# EAGLE design AlimSoloBatterie (EAGLE 9.3.0)
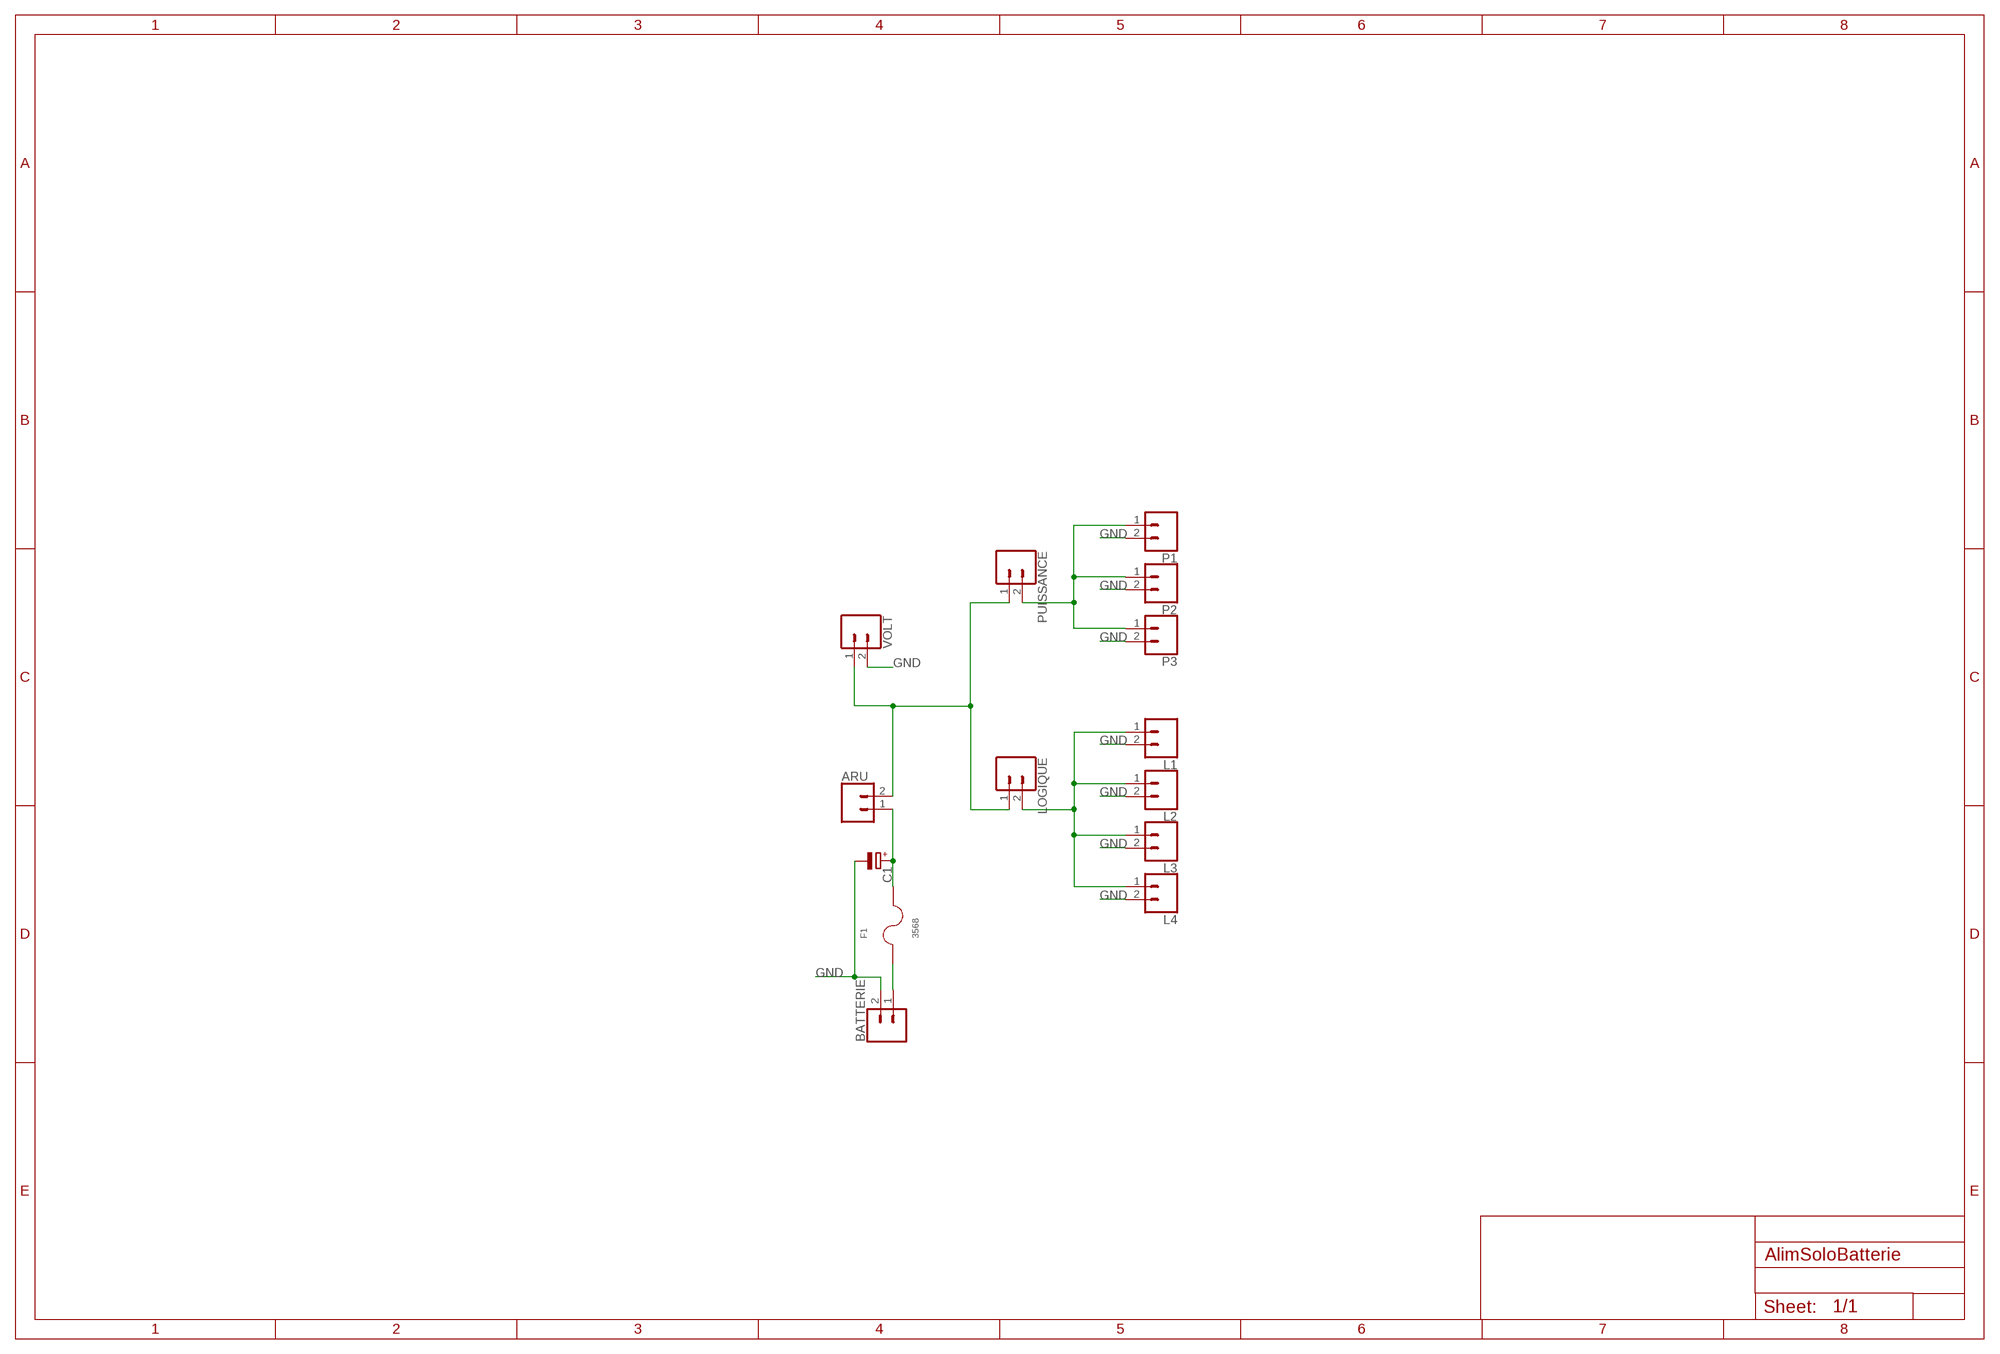
[diagram p0: schematic, sheet 1]

## Parts
ARU  CONN_02POLAR  [MOLEX-1X2]
BATTERIE  CONN_02POLAR  [MOLEX-1X2]
C1  CPOL-EUE5-13  [E5-13]
F1  3568  [FUSE_3568]
L1  CONN_02POLAR  [MOLEX-1X2]
L2  CONN_02POLAR  [MOLEX-1X2]
L3  CONN_02POLAR  [MOLEX-1X2]
L4  CONN_02POLAR  [MOLEX-1X2]
LOGIQUE  CONN_02POLAR  [MOLEX-1X2]
P1  CONN_02POLAR  [MOLEX-1X2]
P2  CONN_02POLAR  [MOLEX-1X2]
P3  CONN_02POLAR  [MOLEX-1X2]
PUISSANCE  CONN_02POLAR  [MOLEX-1X2]
VOLT  CONN_02POLAR  [MOLEX-1X2]

## Nets
GND: BATTERIE.2 C1.- L1.2 L2.2 L3.2 L4.2 P1.2 P2.2 P3.2 VOLT.2
N$1: BATTERIE.1 F1.1 F1.3
N$2: ARU.1 C1.+ F1.2 F1.4
N$3: ARU.2 LOGIQUE.1 PUISSANCE.1 VOLT.1
N$4: P1.1 P2.1 P3.1 PUISSANCE.2
N$5: L1.1 L2.1 L3.1 L4.1 LOGIQUE.2

## Library data of the parts
ARU BATTERIE L1-L4 LOGIQUE P1-P3 PUISSANCE VOLT = SparkFun-Connectors:CONN_02: Multi connection point. Often used as Generic Header-pin footprint for 0.1 inch spaced/style header connections On any of the 0.1 inch spaced packages, you can populate with these: Break Away Headers - Straight <https://www.sparkfun.com/products/116> (PRT-00116) Break Away Male Headers - Right Angle <https://www.sparkfun.com/products/553> (PRT-00553) Female Headers <https://www.sparkfun.com/products/115> (PRT-00115) Break Away Headers - Machine Pin <https://www.sparkfun.com/products/117> (PRT-00117) Break Away Female Headers - Swiss Machine Pin <https://www.sparkfun.com/products/743> (PRT-00743) For SCREWTERMINALS and SPRING TERMINALS visit here: Screw Terimnals on SparkFun.com <https://www.sparkfun.com/search/results?term=Screw+Terminals> (5mm/3.5mm/2.54mm spacing) This device is also useful as a general connection point to wire up your design to another part of your project. Our various solder wires solder well into these plated through hole pads. Hook-Up Wire - Assortment (Stranded, 22 AWG) <https://www.sparkfun.com/products/11375> (PRT-11375) Hook-Up Wire - Assortment (Solid Core, 22 AWG) <https://www.sparkfun.com/products/11367> (PRT-11367) View the entire wire category on our website here <https://www.sparkfun.com/categories/141> Special notes: Molex polarized connector foot print use with: PRT-08233 with associated crimp pins and housings. 2.54_SCREWTERM for use with PRT-10571. 3.5mm Screw Terminal footprints for PRT-08084 5mm Screw Terminal footprints for use with PRT-08432; SF_ID: PRT-09918
C1 = rcl:CPOL-EU: POLARIZED CAPACITOR, European symbol; SPICEPREFIX: C
F1 = CarFuseHolder:3568: Check availability <https://pricing.snapeda.com/parts/3568/Keystone%20Electronics/view-part?ref=eda>; AVAILABILITY: In Stock; DESCRIPTION: THM-Vertical Entry Mini Auto Blade Fuse Holder; MF: Keystone Electronics; MP: 3568; PACKAGE: NON STANDARD Keystone; PRICE: None; PURCHASE-URL: https://pricing.snapeda.com/search/part/3568/?ref=eda

## Board
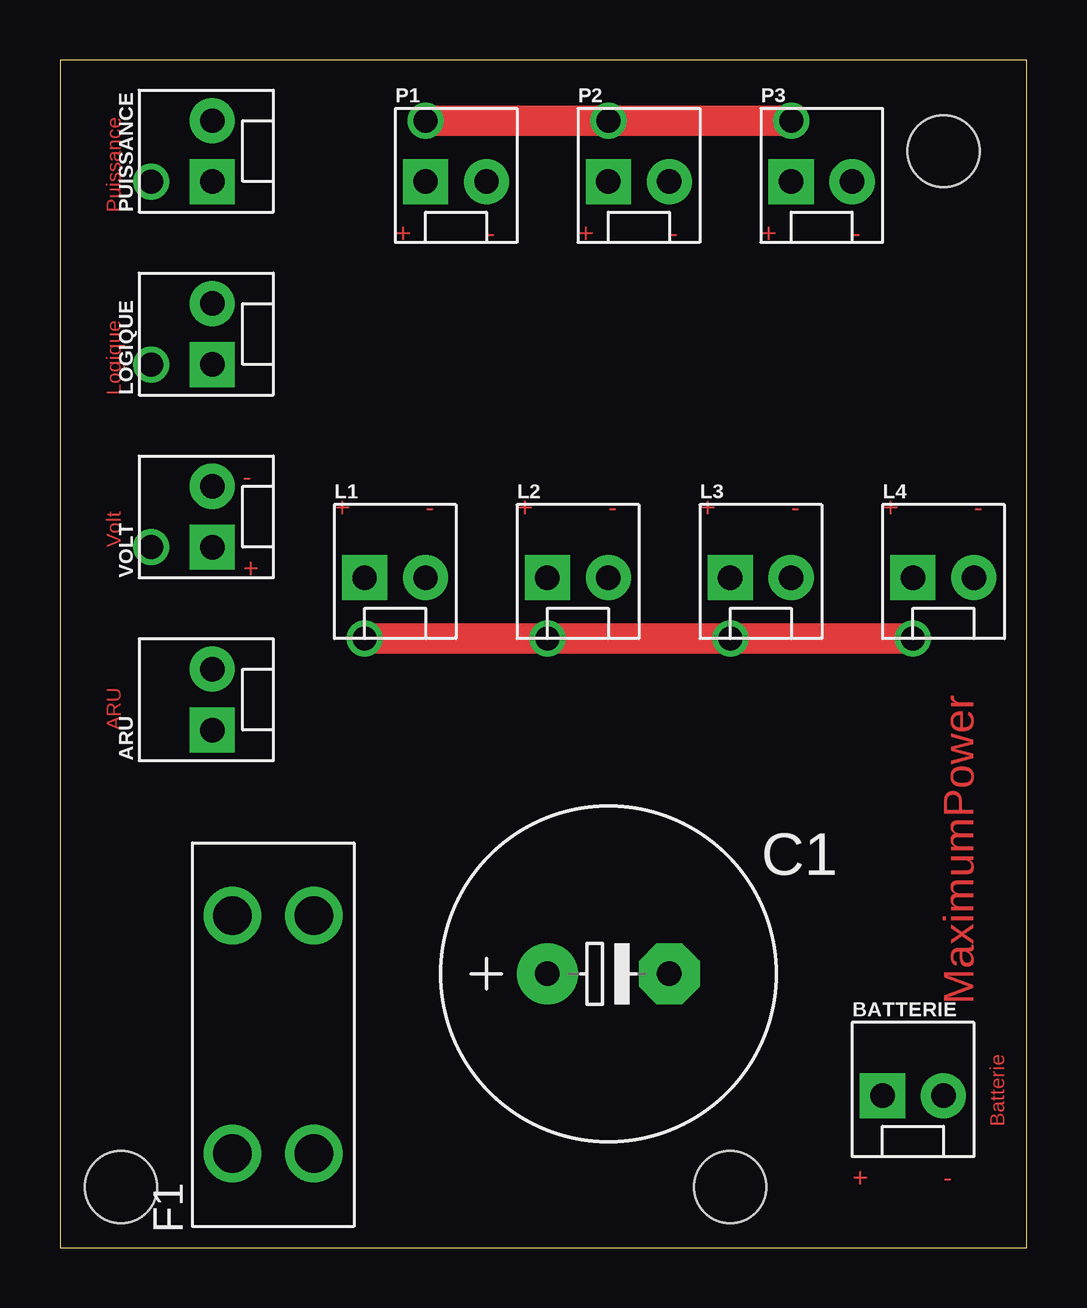
[diagram p1: board, top side]
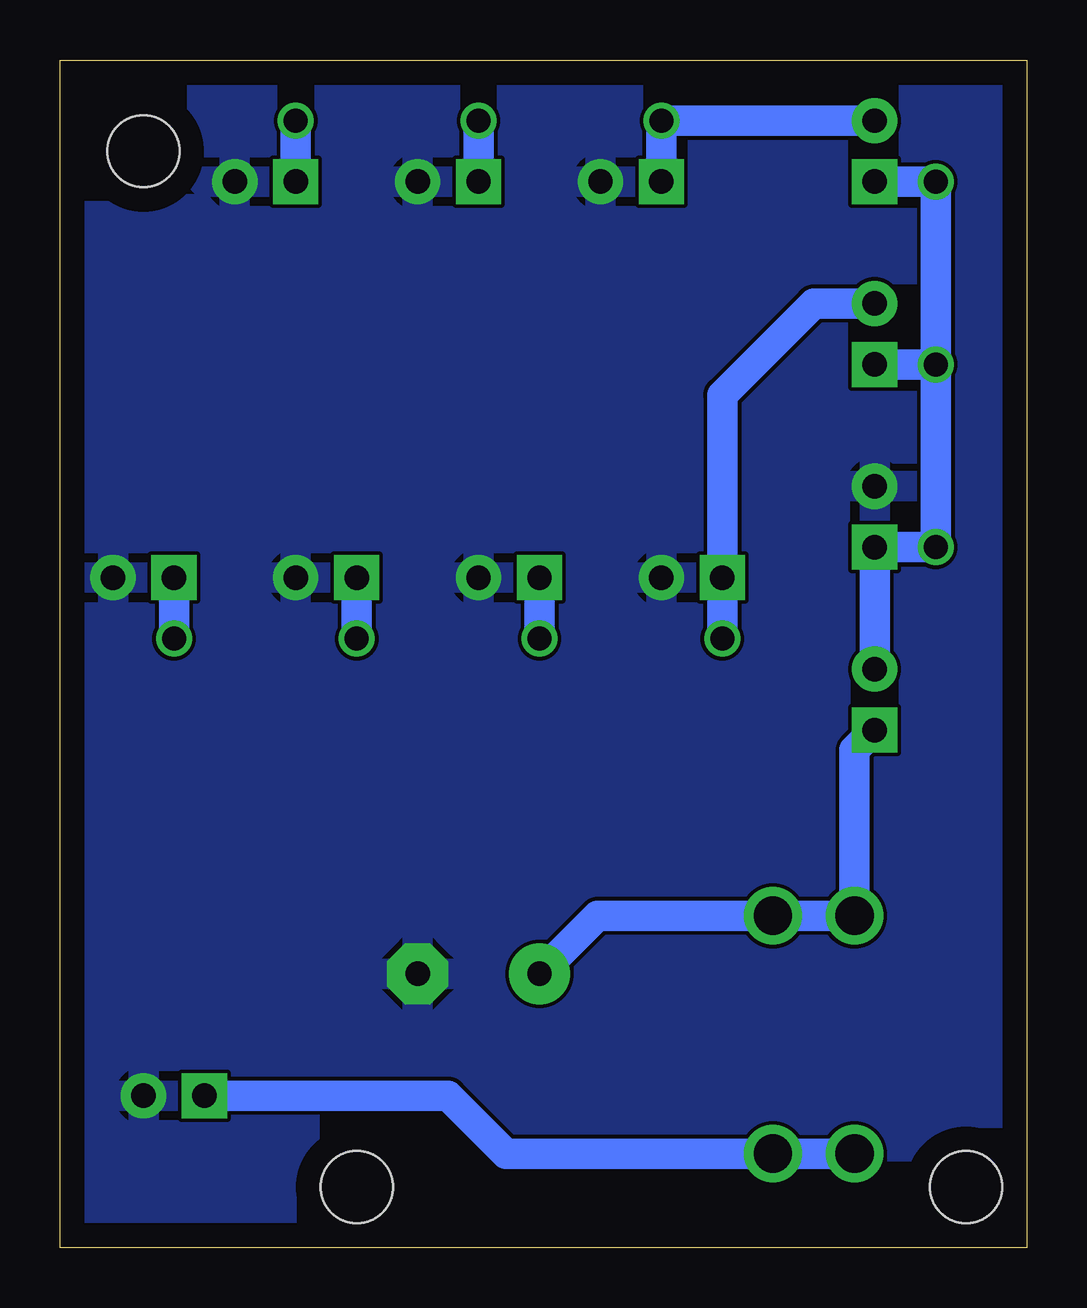
[diagram p2: board, bottom side, seen from below]

Size 40.31 x 49.52 mm. Coordinates in mm from the lower left corner, seen from the top.
Outline: 0,0 40.31,0 40.31,49.52 0,49.52 0,0
Copper layers (1*16): Top 0.035mm / dielectric 1.5mm / Bottom 0.035mm
Design rules "default": minimum track width 6mil, minimum drill 0.35mm, track to track 6mil, track to pad 6mil, pad to pad 6mil, via to via 6mil, smd to smd 6mil, copper to edge 40mil, drill to drill 6mil, minimum pad ring 10mil, minimum via ring 8mil, stop-mask expansion 4mil, vias tented up to drill 0mil, thermal gap 10mil
Holes 3 mm at 36.83,45.72 27.94,2.54 2.54,2.54

### Footprints (pad centres in the part's own frame; a part is rotated, then mirrored left to right if it is on the bottom)
MOLEX-1X2 = drill 1.016 pad 1.88 square: 1 0,0 | drill 1.016 pad 1.88: 2 2.54,0
E5-13 = drill 1.016 pad 2.54: + -2.54,0 | drill 1.016 pad 2.54 octagon: - 2.54,0
FUSE_3568 = drill 1.6: 1 -4.96,1.7; 2 4.96,1.7; 3 -4.96,-1.7; 4 4.96,-1.7

### Placement (x,y rotation side)
ARU  6.35,21.59 90 top
BATTERIE  34.29,6.35 0 top
C1  22.86,11.43 0 top
F1  8.89,8.89 90 top
L1  12.7,27.94 0 top
L2  20.32,27.94 0 top
L3  27.94,27.94 0 top
L4  35.56,27.94 0 top
LOGIQUE  6.35,36.83 90 top
P1  15.24,44.45 0 top
P2  22.86,44.45 0 top
P3  30.48,44.45 0 top
PUISSANCE  6.35,44.45 90 top
VOLT  6.35,29.21 90 top

### Tracks (layer width: path | path; a pad name or v marks a point on that pad's centre or on a via)
GND
  pour Bottom: 0,49.53 40.64,49.53 40.64,0 0,0
N$1
  Bottom 1.27: 10.71,3.81 F1.3 | F1.3 F1.1 | F1.3 21.71,3.93 24.13,6.35 BATTERIE.1
N$2
  Bottom 1.27: C1.+ 17.9,13.85 F1.4 F1.2 7.19,20.75 ARU.1
N$3  (via drill 1)
  Bottom 1.27: ARU.2 VOLT.1 v3.81,29.21 v3.81,36.83 | LOGIQUE.1 v3.81,36.83 | PUISSANCE.1 v3.81,44.45 v3.81,36.83
N$4  (via drill 1)
  Top 1.27: v15.24,46.99 v22.86,46.99 v30.48,46.99
  Bottom 1.27: PUISSANCE.2 v15.24,46.99 P1.1 | v30.48,46.99 P3.1 | P2.1 v22.86,46.99
N$5  (via drill 1)
  Top 1.27: v12.7,25.4 v20.32,25.4 v27.94,25.4 v35.56,25.4
  Bottom 1.27: LOGIQUE.2 8.89,39.37 12.7,35.56 L1.1 v12.7,25.4 | v35.56,25.4 L4.1 | L3.1 v27.94,25.4 | L2.1 v20.32,25.4

### Text on the board
Top: Puissance | + | - | + | - | + | - | Logique | - | + | - | + | - | + | - | + | - | Volt | + | ARU | MaximumPower | Batterie | + | -